# Altium schematic sheet Optocouplers.SchDoc: Optoisolators
size A3; Author: M.Beldyga; CompanyName: WUT ISE; DrawnBy: M.Beldyga; Organization: WUT ISE; Address1: PW ISE; Address2: Nowowiejska 15/19 00-665 Warsaw; Address3: micbeldyga@gmail.com; SheetNumber: 9; SheetTotal: 11; ModifiedBy: -; CheckedDate: -; DivGrp: WUT ISE; Designer: M.Beldyga; ModifiedDate: -; ProjectName: Sensor Box
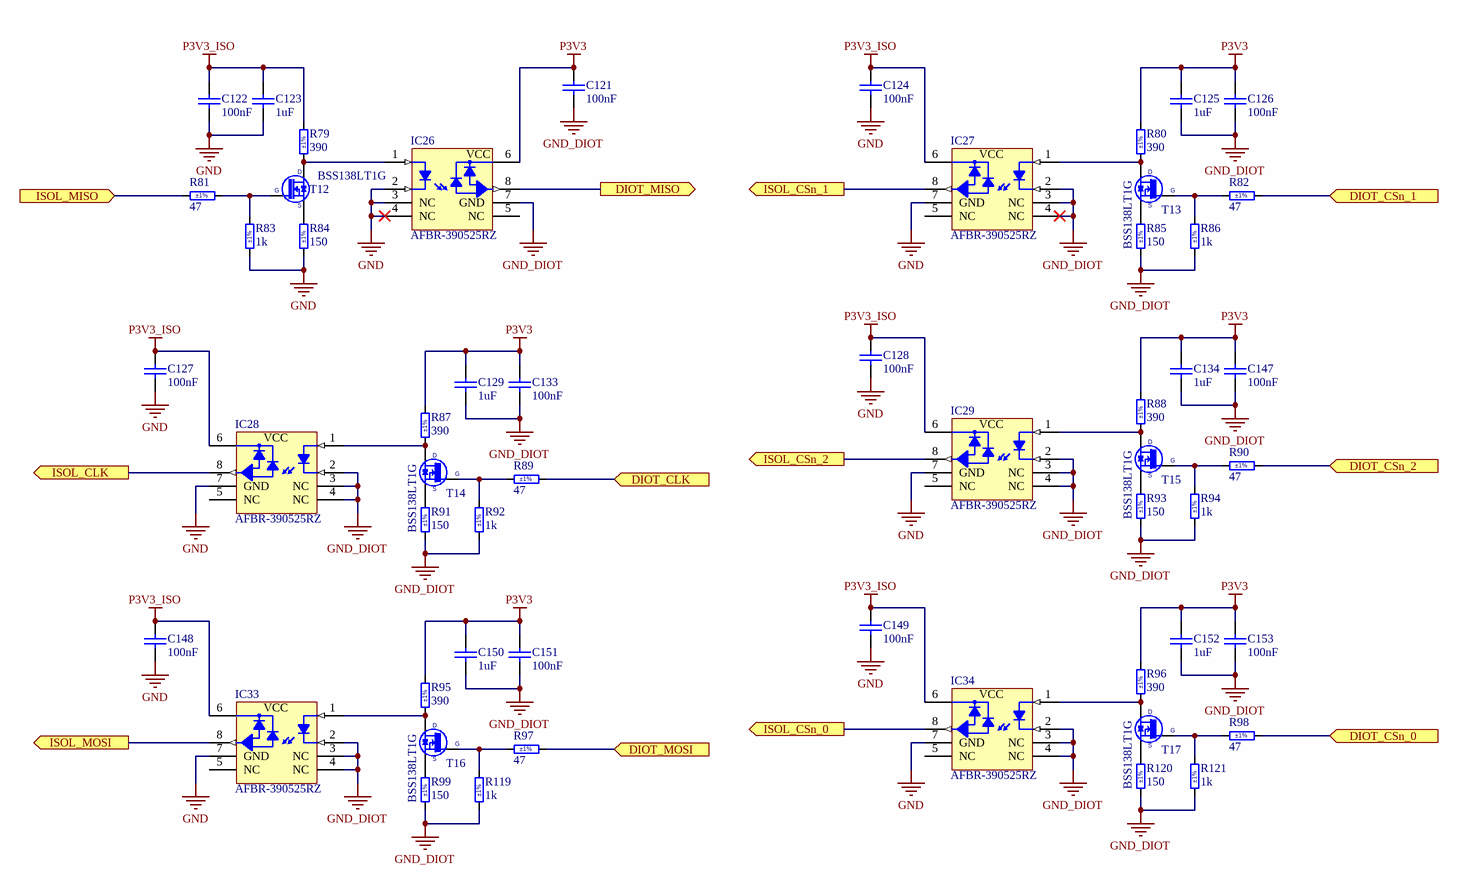
[diagram p0: Optocouplers.SchDoc]

## Parts
C121  100nF  [CAPC1005X55N]
C122  100nF  [CAPC1005X55N]
C123  1uF  [CAPC1005X55N]
C124  100nF  [CAPC1005X55N]
C125  1uF  [CAPC1005X55N]
C126  100nF  [CAPC1005X55N]
C127  100nF  [CAPC1005X55N]
C128  100nF  [CAPC1005X55N]
C129  1uF  [CAPC1005X55N]
C133  100nF  [CAPC1005X55N]
C134  1uF  [CAPC1005X55N]
C147  100nF  [CAPC1005X55N]
C148  100nF  [CAPC1005X55N]
C149  100nF  [CAPC1005X55N]
C150  1uF  [CAPC1005X55N]
C151  100nF  [CAPC1005X55N]
C152  1uF  [CAPC1005X55N]
C153  100nF  [CAPC1005X55N]
IC26  AFBR-390525RZ  [BROADCOM_AFBR-390525RZ]
IC27  AFBR-390525RZ  [BROADCOM_AFBR-390525RZ]
IC28  AFBR-390525RZ  [BROADCOM_AFBR-390525RZ]
IC29  AFBR-390525RZ  [BROADCOM_AFBR-390525RZ]
IC33  AFBR-390525RZ  [BROADCOM_AFBR-390525RZ]
IC34  AFBR-390525RZ  [BROADCOM_AFBR-390525RZ]
R79  390  Tolerance: ±1%  [RESC1005X40N]
R80  390  Tolerance: ±1%  [RESC1005X40N]
R81  47  Tolerance: ±1%  [RESC1005X40N]
R82  47  Tolerance: ±1%  [RESC1005X40N]
R83  1k  Tolerance: ±1%  [RESC1005X40N]
R84  150  Tolerance: ±1%  [RESC1005X40N]
R85  150  Tolerance: ±1%  [RESC1005X40N]
R86  1k  Tolerance: ±1%  [RESC1005X40N]
R87  390  Tolerance: ±1%  [RESC1005X40N]
R88  390  Tolerance: ±1%  [RESC1005X40N]
R89  47  Tolerance: ±1%  [RESC1005X40N]
R90  47  Tolerance: ±1%  [RESC1005X40N]
R91  150  Tolerance: ±1%  [RESC1005X40N]
R92  1k  Tolerance: ±1%  [RESC1005X40N]
R93  150  Tolerance: ±1%  [RESC1005X40N]
R94  1k  Tolerance: ±1%  [RESC1005X40N]
R95  390  Tolerance: ±1%  [RESC1005X40N]
R96  390  Tolerance: ±1%  [RESC1005X40N]
R97  47  Tolerance: ±1%  [RESC1005X40N]
R98  47  Tolerance: ±1%  [RESC1005X40N]
R99  150  Tolerance: ±1%  [RESC1005X40N]
R119  1k  Tolerance: ±1%  [RESC1005X40N]
R120  150  Tolerance: ±1%  [RESC1005X40N]
R121  1k  Tolerance: ±1%  [RESC1005X40N]
T12  BSS138LT1G  [SOT95P240X110-3N]
T13  BSS138LT1G  [SOT95P240X110-3N]
T14  BSS138LT1G  [SOT95P240X110-3N]
T15  BSS138LT1G  [SOT95P240X110-3N]
T16  BSS138LT1G  [SOT95P240X110-3N]
T17  BSS138LT1G  [SOT95P240X110-3N]

## Ports
DIOT_CLK (in), DIOT_CSn_0 (in), DIOT_CSn_1 (in), DIOT_CSn_2 (in), DIOT_MISO (out), DIOT_MOSI (in), ISOL_CLK (out), ISOL_CSn_0 (out), ISOL_CSn_1 (out), ISOL_CSn_2 (out), ISOL_MISO (in), ISOL_MOSI (out)

## Nets
GND: C122.1 C123.1 C124.1 C127.1 C128.1 C148.1 C149.1 IC26.2(C) IC26.3(NC) IC26.4(NC) IC27.7(GND) IC28.7(GND) IC29.7(GND) IC33.7(GND) IC34.7(GND) R83.1 R84.1
GND_DIOT: C121.1 C125.1 C126.1 C129.1 C133.1 C134.1 C147.1 C150.1 C151.1 C152.1 C153.1 IC26.7(GND) IC27.2(C) IC27.3(NC) IC27.4(NC) IC28.2(C) IC28.3(NC) IC28.4(NC) IC29.2(C) IC29.3(NC) IC29.4(NC) IC33.2(C) IC33.3(NC) IC33.4(NC) IC34.2(C) IC34.3(NC) IC34.4(NC) R85.1 R86.1 R91.1 R92.1 R93.1 R94.1 R99.1 R119.1 R120.1 R121.1
P3V3: C121.2 C125.2 C126.2 C129.2 C133.2 C134.2 C147.2 C150.2 C151.2 C152.2 C153.2 IC26.6(VCC) R80.2 R87.2 R88.2 R95.2 R96.2
P3V3_ISO: C122.2 C123.2 C124.2 C127.2 C128.2 C148.2 C149.2 IC27.6(VCC) IC28.6(VCC) IC29.6(VCC) IC33.6(VCC) IC34.6(VCC) R79.2
DIOT_CLK: R89.2 ; port DIOT_CLK
DIOT_CSn_0: R98.2 ; port DIOT_CSn_0
DIOT_CSn_1: R82.2 ; port DIOT_CSn_1
DIOT_CSn_2: R90.2 ; port DIOT_CSn_2
DIOT_MISO: IC26.8(DATA_OUT) ; port DIOT_MISO
DIOT_MOSI: R97.2 ; port DIOT_MOSI
ISOL_CLK: IC28.8(DATA_OUT) ; port ISOL_CLK
ISOL_CSn_0: IC34.8(DATA_OUT) ; port ISOL_CSn_0
ISOL_CSn_1: IC27.8(DATA_OUT) ; port ISOL_CSn_1
ISOL_CSn_2: IC29.8(DATA_OUT) ; port ISOL_CSn_2
ISOL_MISO: R81.2 ; port ISOL_MISO
ISOL_MOSI: IC33.8(DATA_OUT) ; port ISOL_MOSI
NetIC26_1: IC26.1(A) R79.1 T12.3(D)
NetIC27_1: IC27.1(A) R80.1 T13.3(D)
NetIC28_1: IC28.1(A) R87.1 T14.3(D)
NetIC29_1: IC29.1(A) R88.1 T15.3(D)
NetIC33_1: IC33.1(A) R95.1 T16.3(D)
NetIC34_1: IC34.1(A) R96.1 T17.3(D)
NetR81_1: R81.1 R83.2 T12.1(G)
NetR82_1: R82.1 R86.2 T13.1(G)
NetR84_2: R84.2 T12.2(S)
NetR85_2: R85.2 T13.2(S)
NetR89_1: R89.1 R92.2 T14.1(G)
NetR90_1: R90.1 R94.2 T15.1(G)
NetR91_2: R91.2 T14.2(S)
NetR93_2: R93.2 T15.2(S)
NetR97_1: R97.1 R119.2 T16.1(G)
NetR98_1: R98.1 R121.2 T17.1(G)
NetR99_2: R99.2 T16.2(S)
NetR120_2: R120.2 T17.2(S)

Not connected (* = marked no-connect by the designer): IC26 5(NC); IC27 5(NC); IC28 5(NC); IC29 5(NC); IC33 5(NC); IC34 5(NC)

## Notes on the sheet
- Project/Equipment
- Document
- Designer
- Drawn by
- Check.by
- Contact
- File
- Last Mod.
- Print Date
- Sheet
- Size
- A3
- of
- Rev

## Library data of the parts
C121 C122 C124 C126-C128 C133 C147-C149 C151 C153 = CC0402_100NF_50V_10%_X7R: Non-polarised capacitor; Part Description: SMD Multilayer Chip Ceramic Capacitor; Manufacturer: GENERIC; Manufacturer1 Part Number: GRM155R71H104KE14D; Voltage: 50V; TC: X7R; Tolerance: ±10%; Part Number: CC0402_100NF_50V_10%_X7R; Component Kind: Standard; Component Type: Standard; Pin Count: 2; Value: 100nF; Status: None; Manufacturer Part Number: CC0402_100NF_50V_10%_X7R; Case: 0402; Mounted: Yes; Socket: No; SMD: Yes; Sense: No; Manufacturer1 Example: MURATA; Manufacturer1 ComponentHeight: 0.55mm; HelpURL: \\cern.ch\dfs\Applications\Altium\Datasheets\CC0402_MURATA_GRM155R71H104KE14D.pdf; Author: CERN DEM MR; CreateDate: 6/30/2017; LatestRevisionDate: 6/30/2017
C123 C125 C129 C134 C150 C152 = CC0402_1UF_16V_10%_X5R: Non-polarised capacitor; Part Description: SMD Multilayer Chip Ceramic Capacitor; Manufacturer: GENERIC; Manufacturer1 Part Number: C1005X5R1C105KT; Voltage: 16V; TC: X5R; Tolerance: ±10%; Part Number: CC0402_1UF_16V_10%_X5R; Component Kind: Standard; Component Type: Standard; Pin Count: 2; Value: 1uF; Status: Preferred; Manufacturer Part Number: CC0402_1UF_16V_10%_X5R; Case: 0402; Mounted: Yes; Socket: No; SMD: Yes; Sense: No; Manufacturer1 Example: TDK; Manufacturer1 ComponentHeight: 0.55mm; HelpURL: \\cern.ch\dfs\Applications\Altium\Datasheets\CC0402_X5R_TDK_C.pdf; Author: CERN DEM JLC; CreateDate: 10/25/2012; LatestRevisionDate: 10/25/2012
IC26-IC29 IC33 IC34 = AFBR-390525RZ: High Voltage Galvanic Insulation Link for DC to 5MBaud; Part Description: High Voltage Galvanic Insulation Link for DC to 5MBaud, Length 25mm, 15kV Voltage Suppression; Manufacturer: BROADCOM; PressFit: No; Bonding: No; Part Number: AFBR-390525RZ; Component Kind: Standard; Component Type: Standard; Device: AFBR-390525RZ; PackageDescription: BROADCOM AFBR-390525RZ Case, Body 30.46mm L X 10.16mm W X 6.7mm H; Manufacturer Part Number: AFBR-390525RZ; Pin Count: 8; Mounted: Yes; Socket: No; SMD: No; Sense: No; ComponentHeight: 6.7mm; HelpURL: \\cern.ch\dfs\Applications\Altium\Datasheets\AFBR-390525RZ.pdf; Author: CERN DEM HF; CreateDate: 2/10/2022; LatestRevisionDate: 3/21/2022
R79 R80 R87 R88 R95 R96 = R0402_390R_1%_0.0625W_100PPM: Resistor - 1%; Part Description: General Purpose Thick Film Chip Resistor; Manufacturer: GENERIC; Manufacturer1 Part Number: 232270673901L; TC: ±100ppm/°C; PressFit: No; Part Number: R0402_390R_1%_0.0625W_100PPM; Component Kind: Standard; Component Type: Standard; Pin Count: 2; Value: 390; Status: Not Recommended; Power: 0.0625W; Manufacturer Part Number: R0402_390R_1%_0.0625W_100PPM; Case: 0402; Mounted: Yes; Sense: No; Socket: No; SMD: Yes; Manufacturer1 Example: YAGEO PHYCOMP; Manufacturer1 ComponentHeight: 0.4mm; HelpURL: \\cern.ch\dfs\Applications\Altium\Datasheets\R0402_Phycomp_RC0402.pdf; Author: CERN DEM JLC; CreateDate: 12/3/2007; LatestRevisionDate: 10/17/2012
R81 R82 R89 R90 R97 R98 = R0402_47R_1%_0.0625W_100PPM: Resistor - 1%; Part Description: General Purpose Thick Film Chip Resistor; Manufacturer: GENERIC; Manufacturer1 Part Number: 232270674709L; TC: ±100ppm/°C; PressFit: No; Part Number: R0402_47R_1%_0.0625W_100PPM; Component Kind: Standard; Component Type: Standard; Pin Count: 2; Value: 47; Status: Not Recommended; Power: 0.0625W; Manufacturer Part Number: R0402_47R_1%_0.0625W_100PPM; Case: 0402; Mounted: Yes; Sense: No; Socket: No; SMD: Yes; Manufacturer1 Example: YAGEO PHYCOMP; Manufacturer1 ComponentHeight: 0.4mm; HelpURL: \\cern.ch\dfs\Applications\Altium\Datasheets\R0402_Phycomp_RC0402.pdf; Author: CERN DEM JLC; CreateDate: 12/3/2007; LatestRevisionDate: 10/17/2012
R83 R86 R92 R94 R119 R121 = R0402_1K_1%_0.0625W_100PPM: Resistor - 1%; Part Description: General Purpose Thick Film Chip Resistor; Manufacturer: GENERIC; Manufacturer1 Part Number: 232270671002L; TC: ±100ppm/°C; PressFit: No; Part Number: R0402_1K_1%_0.0625W_100PPM; Component Kind: Standard; Component Type: Standard; Pin Count: 2; Value: 1k; Status: Not Recommended; Power: 0.0625W; Manufacturer Part Number: R0402_1K_1%_0.0625W_100PPM; Case: 0402; Mounted: Yes; Sense: No; Socket: No; SMD: Yes; Manufacturer1 Example: YAGEO PHYCOMP; Manufacturer1 ComponentHeight: 0.4mm; HelpURL: \\cern.ch\dfs\Applications\Altium\Datasheets\R0402_Phycomp_RC0402.pdf; Author: CERN DEM JLC; CreateDate: 12/3/2007; LatestRevisionDate: 10/17/2012
R84 R85 R91 R93 R99 R120 = R0402_150R_1%_0.0625W_100PPM: Resistor - 1%; Part Description: General Purpose Thick Film Chip Resistor; Manufacturer: GENERIC; Manufacturer1 Part Number: 232270671501L; TC: ±100ppm/°C; PressFit: No; Part Number: R0402_150R_1%_0.0625W_100PPM; Component Kind: Standard; Component Type: Standard; Pin Count: 2; Value: 150; Status: Not Recommended; Power: 0.0625W; Manufacturer Part Number: R0402_150R_1%_0.0625W_100PPM; Case: 0402; Mounted: Yes; Sense: No; Socket: No; SMD: Yes; Manufacturer1 Example: YAGEO PHYCOMP; Manufacturer1 ComponentHeight: 0.4mm; HelpURL: \\cern.ch\dfs\Applications\Altium\Datasheets\R0402_Phycomp_RC0402.pdf; Author: CERN DEM JLC; CreateDate: 12/3/2007; LatestRevisionDate: 10/17/2012
T12-T17 = BSS138LT1G: N-CHANNEL MOSFET WITH DIODE; Part Description: 50V 200mA N-Channel Enhancement Mode Field-Effect Transistor; Manufacturer: ON SEMICONDUCTOR; PressFit: No; Bonding: No; Part Number: BSS138LT1G; Component Kind: Standard; Component Type: Standard; Device: BSS138LT1G; PackageDescription: SOT23 3-Leads, Pitch 0.95mm - Body 1.4x3mm, IPC Medium Density; Manufacturer Part Number: BSS138LT1G; Pin Count: 3; Case: SOT23-3; Mounted: Yes; Socket: No; SMD: Yes; Sense: No; ComponentHeight: 1.11mm; HelpURL: \\cern.ch\dfs\Applications\Altium\Datasheets\BSS138LT1G.pdf; Author: CERN DEM JLC; CreateDate: 23.03.2009; LatestRevisionDate: 23.03.2009